# EAGLE design PAC_MiP POV v18_10_18_17_new_02 (EAGLE 8.3.2)
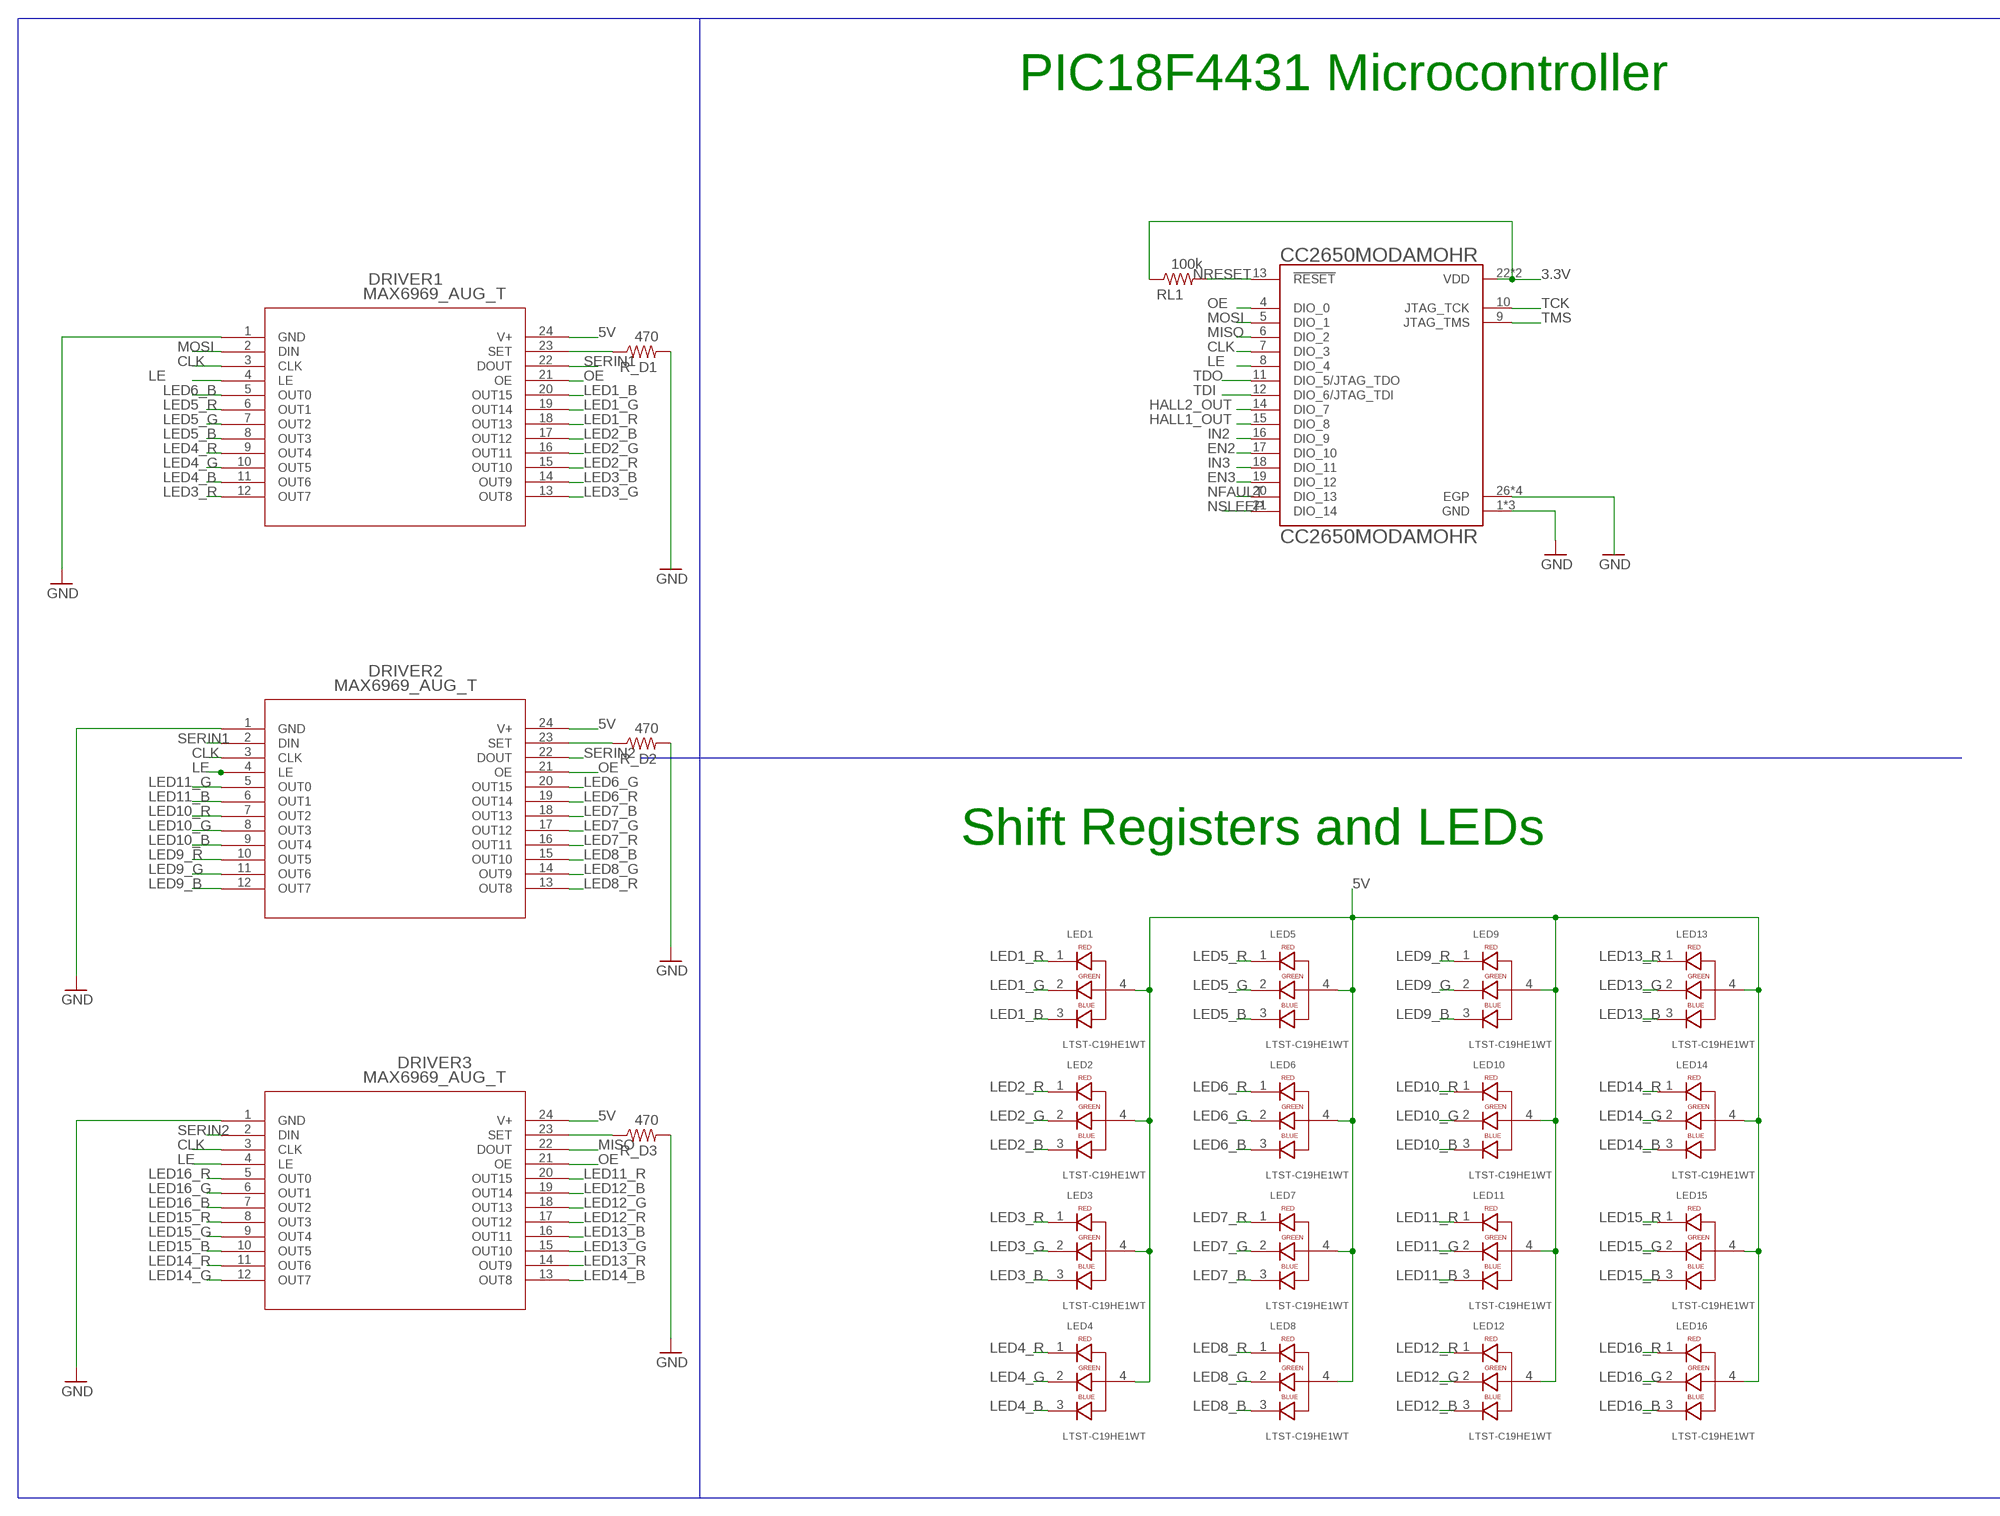
[diagram p0: schematic, sheet 1, part 1 of 2]
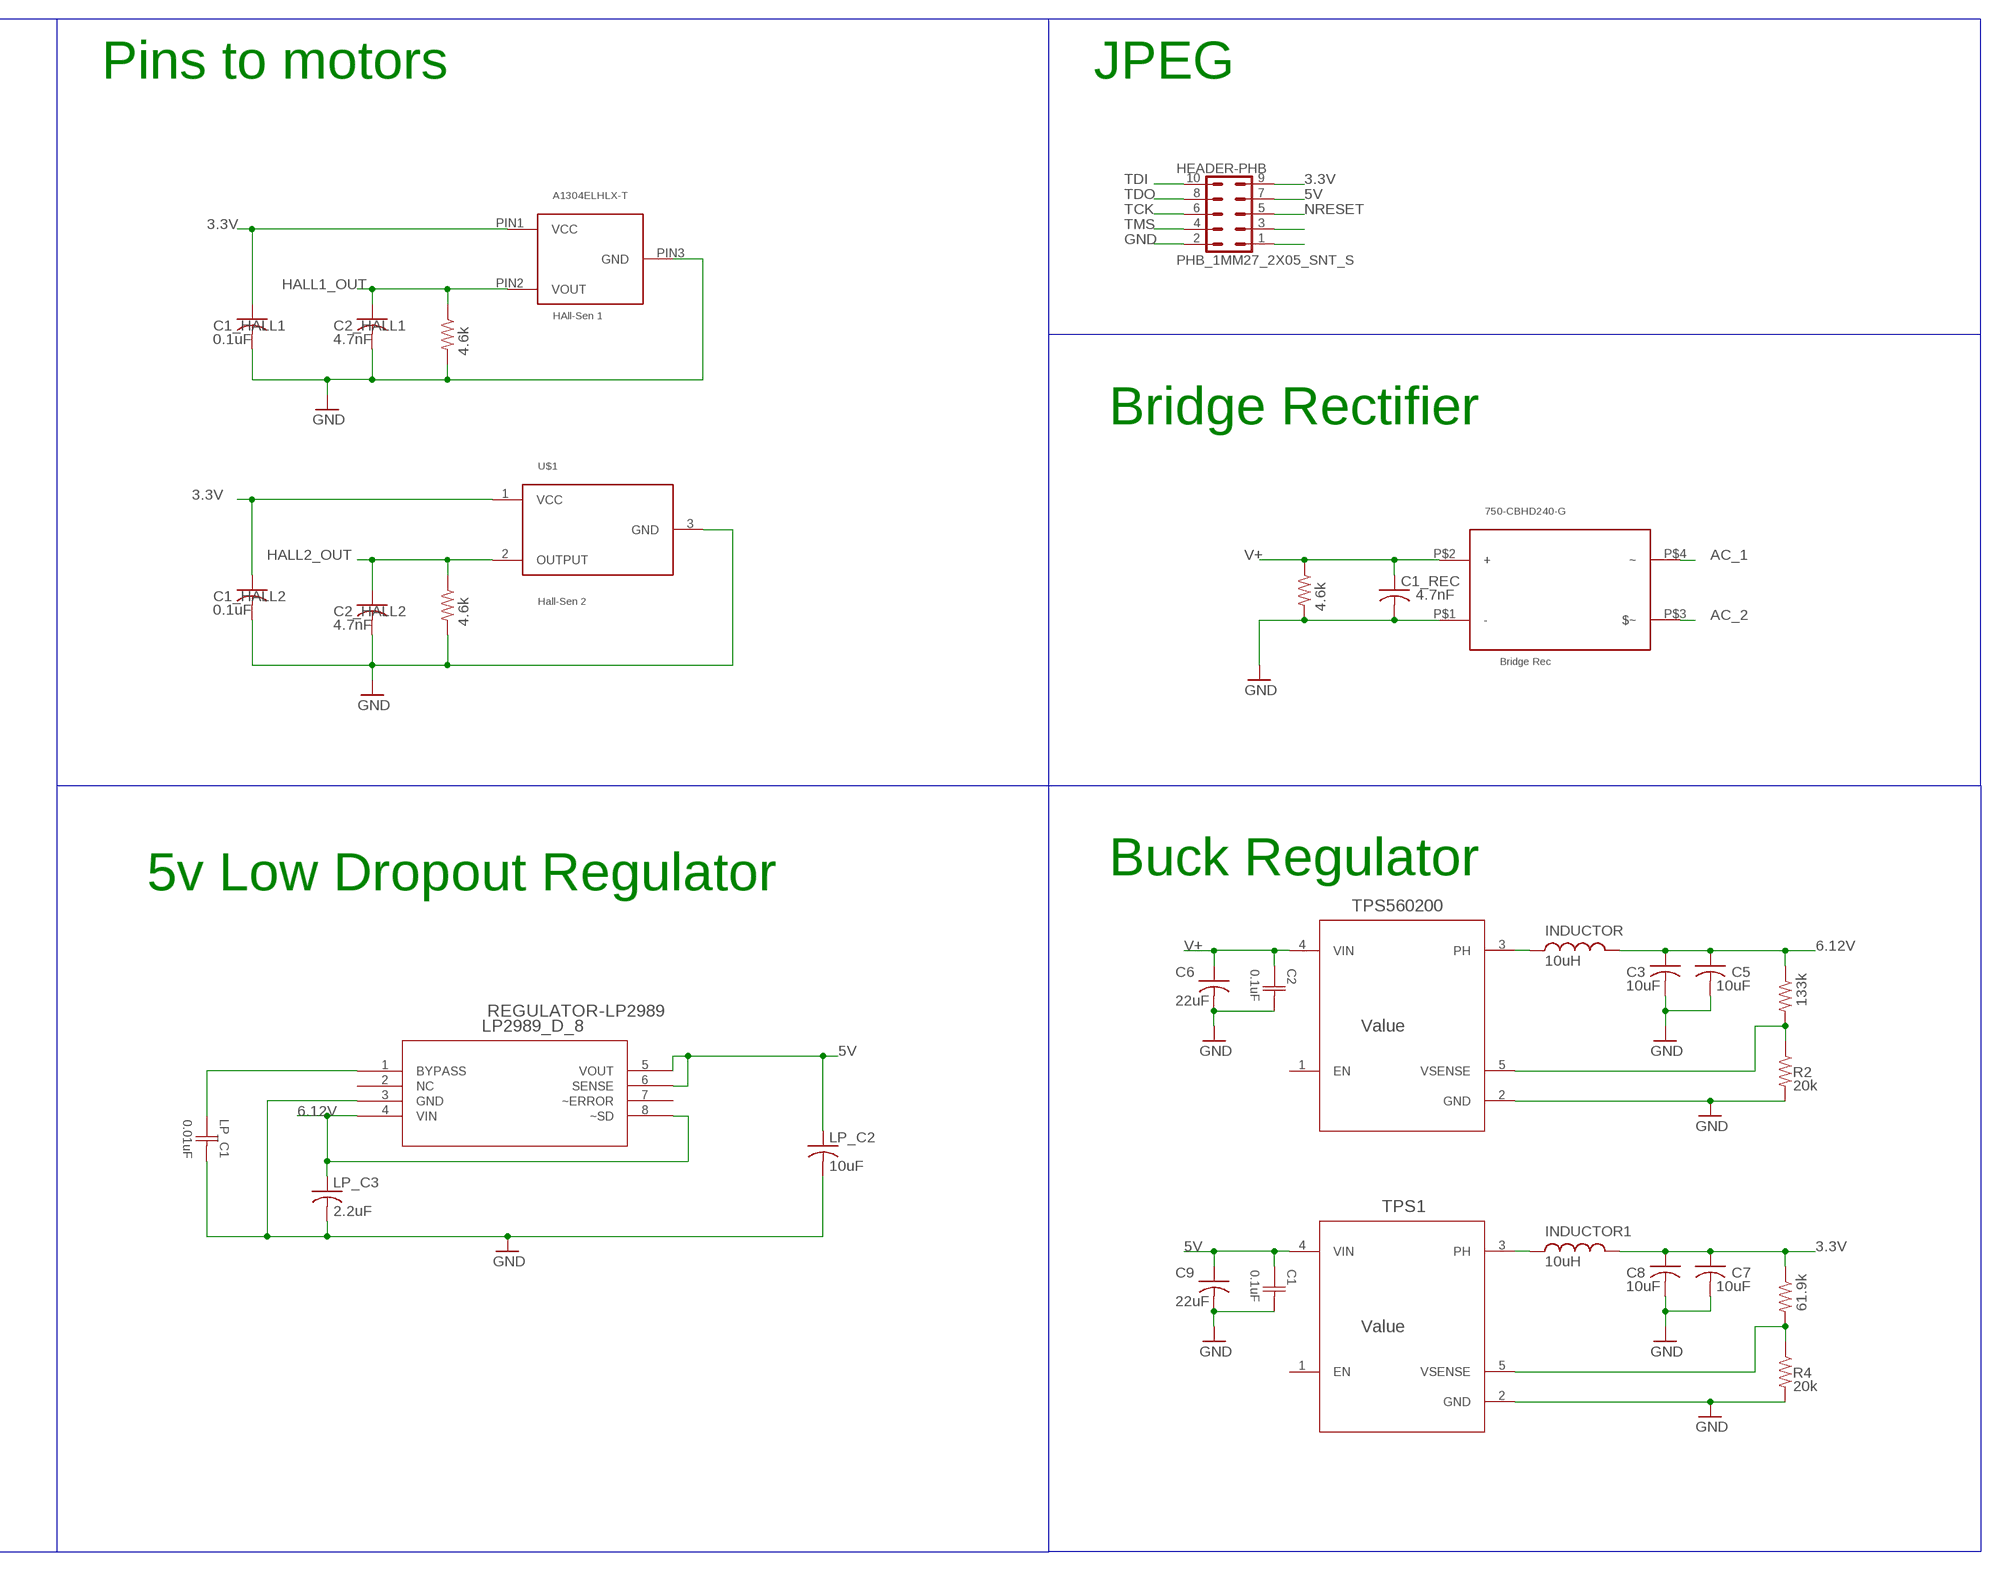
[diagram p1: schematic, sheet 1, part 2 of 2]

## Parts
750-CBHD240-G  Bridge Rec  750-CDBHD240-G  [750-CDBHD240-G]
A1304ELHLX-T  HAll-Sen 1  A1304ELHLX-T  [A1304ELHLX-T]
C1  0.1uF  05083C104MAT2A  [0508]
C1_HALL1  0.1uF  C-USC0805  [C0805]
C1_HALL2  0.1uF  C-USC0805  [C0805]
C1_REC  4.7nF  C-USC0805  [C0805]
C2  0.1uF  05083C104MAT2A  [0508]
C2_HALL1  4.7nF  C-USC0805  [C0805]
C2_HALL2  4.7nF  C-USC0805  [C0805]
C3  10uF  C-USC0805  [C0805]
C5  10uF  C-USC0805  [C0805]
C6  22uF  C-USC0805  [C0805]
C7  10uF  C-USC0805  [C0805]
C8  10uF  C-USC0805  [C0805]
C9  22uF  C-USC0805  [C0805]
CC2650MODAMOHR  CC2650MODAMOHR  [XCVR_CC2650MODAMOHR]
DRIVER1  MAX6969_AUG_T  [21_0066J_24]
DRIVER2  MAX6969_AUG_T  [21_0066J_24]
DRIVER3  MAX6969_AUG_T  [21_0066J_24]
HEADER-PHB  PHB_1MM27_2X05_SNT_S  [PHB_1MM27_2X05_SNT]
INDUCTOR  10uH  INDUCTOR-CDPH1D06F  [CDPH4D19FNP100MC]
INDUCTOR1  10uH  INDUCTOR-CDPH1D06F  [CDPH4D19FNP100MC]
LED1  LTST-C19HE1WT  [LEDSC85P160X160X35-4N]
LED2  LTST-C19HE1WT  [LEDSC85P160X160X35-4N]
LED3  LTST-C19HE1WT  [LEDSC85P160X160X35-4N]
LED4  LTST-C19HE1WT  [LEDSC85P160X160X35-4N]
LED5  LTST-C19HE1WT  [LEDSC85P160X160X35-4N]
LED6  LTST-C19HE1WT  [LEDSC85P160X160X35-4N]
LED7  LTST-C19HE1WT  [LEDSC85P160X160X35-4N]
LED8  LTST-C19HE1WT  [LEDSC85P160X160X35-4N]
LED9  LTST-C19HE1WT  [LEDSC85P160X160X35-4N]
LED10  LTST-C19HE1WT  [LEDSC85P160X160X35-4N]
LED11  LTST-C19HE1WT  [LEDSC85P160X160X35-4N]
LED12  LTST-C19HE1WT  [LEDSC85P160X160X35-4N]
LED13  LTST-C19HE1WT  [LEDSC85P160X160X35-4N]
LED14  LTST-C19HE1WT  [LEDSC85P160X160X35-4N]
LED15  LTST-C19HE1WT  [LEDSC85P160X160X35-4N]
LED16  LTST-C19HE1WT  [LEDSC85P160X160X35-4N]
LP_C1  0.01uF  LLL185R71E103MA01L  [LLL18]
LP_C2  10uF  C-USC0805  [C0805]
LP_C3  2.2uF  C-USC0805  [C0805]
R1  133k  R-US_R0805  [R0805]
R1_HALL  4.6k  R-US_R0805  [R0805]
R1_HALL2  4.6k  R-US_R0805  [R0805]
R1_REC  4.6k  R-US_R0805  [R0805]
R2  20k  R-US_R0805  [R0805]
R3  61.9k  R-US_R0805  [R0805]
R4  20k  R-US_R0805  [R0805]
R_D1  470  R-US_R0805  [R0805]
R_D2  470  R-US_R0805  [R0805]
R_D3  470  R-US_R0805  [R0805]
REGULATOR-LP2989  LP2989_D_8  [M08A]
RL1  100k  R-US_R0805  [R0805]
TPS1  Value  TPS560200DBVR  [DBV0005A_N]
TPS560200  Value  TPS560200DBVR  [DBV0005A_N]
U$1  Hall-Sen 2  SS39ET  [SOT-23-3]

## Nets
3.3V: A1304ELHLX-T.PIN1(VCC) C1_HALL1.1 C1_HALL2.1 C7.1 C8.1 CC2650MODAMOHR.22(VDD) CC2650MODAMOHR.23(VDD) HEADER-PHB.9 INDUCTOR1.P$2 R3.1 RL1.1 U$1.1(VCC)
5V: C1.1 C9.1 DRIVER1.24(V+) DRIVER2.24(V+) DRIVER3.24(V+) HEADER-PHB.7 LED1.4 LED2.4 LED3.4 LED4.4 LED5.4 LED6.4 LED7.4 LED8.4 LED9.4 LED10.4 LED11.4 LED12.4 LED13.4 LED14.4 LED15.4 LED16.4 LP_C2.1 REGULATOR-LP2989.5(VOUT) REGULATOR-LP2989.6(SENSE) TPS1.4(VIN)
6.12V: C3.1 C5.1 INDUCTOR.P$2 LP_C3.1 R1.1 REGULATOR-LP2989.4(VIN) REGULATOR-LP2989.8(~SD)
AC_1: 750-CBHD240-G.P$4(~)
AC_2: 750-CBHD240-G.P$3($~)
CLK: CC2650MODAMOHR.7(DIO_3) DRIVER1.3(CLK) DRIVER2.3(CLK) DRIVER3.3(CLK)
EN2: CC2650MODAMOHR.17(DIO_10)
EN3: CC2650MODAMOHR.19(DIO_12)
GND: 750-CBHD240-G.P$1(-) A1304ELHLX-T.PIN3(GND) C1.2 C1_HALL1.2 C1_HALL2.2 C1_REC.2 C2.2 C2_HALL1.2 C2_HALL2.2 C3.2 C5.2 C6.2 C7.2 C8.2 C9.2 CC2650MODAMOHR.1(GND) CC2650MODAMOHR.3(GND) CC2650MODAMOHR.25(GND) CC2650MODAMOHR.26(EGP) CC2650MODAMOHR.27(EGP) CC2650MODAMOHR.28(EGP) CC2650MODAMOHR.29(EGP) DRIVER1.1(GND) DRIVER2.1(GND) DRIVER3.1(GND) HEADER-PHB.2 LP_C1.2 LP_C2.2 LP_C3.2 R1_HALL2.2 R1_HALL.2 R1_REC.2 R2.2 R4.2 R_D2.2 R_D3.2 REGULATOR-LP2989.3(GND) TPS1.2(GND) TPS560200.2(GND) U$1.3(GND)
HALL1_OUT: A1304ELHLX-T.PIN2(VOUT) C2_HALL1.1 CC2650MODAMOHR.15(DIO_8) R1_HALL.1
HALL2_OUT: C2_HALL2.1 CC2650MODAMOHR.14(DIO_7) R1_HALL2.1 U$1.2(OUTPUT)
IN2: CC2650MODAMOHR.16(DIO_9)
IN3: CC2650MODAMOHR.18(DIO_11)
LE: CC2650MODAMOHR.8(DIO_4) DRIVER1.4(LE) DRIVER2.4(LE) DRIVER3.4(LE)
LED1_B: DRIVER1.20(OUT15) LED1.3
LED1_G: DRIVER1.19(OUT14) LED1.2
LED1_R: DRIVER1.18(OUT13) LED1.1
LED2_B: DRIVER1.17(OUT12) LED2.3
LED2_G: DRIVER1.16(OUT11) LED2.2
LED2_R: DRIVER1.15(OUT10) LED2.1
LED3_B: DRIVER1.14(OUT9) LED3.3
LED3_G: DRIVER1.13(OUT8) LED3.2
LED3_R: DRIVER1.12(OUT7) LED3.1
LED4_B: DRIVER1.11(OUT6) LED4.3
LED4_G: DRIVER1.10(OUT5) LED4.2
LED4_R: DRIVER1.9(OUT4) LED4.1
LED5_B: DRIVER1.8(OUT3) LED5.3
LED5_G: DRIVER1.7(OUT2) LED5.2
LED5_R: DRIVER1.6(OUT1) LED5.1
LED6_B: DRIVER1.5(OUT0) LED6.3
LED6_G: DRIVER2.20(OUT15) LED6.2
LED6_R: DRIVER2.19(OUT14) LED6.1
LED7_B: DRIVER2.18(OUT13) LED7.3
LED7_G: DRIVER2.17(OUT12) LED7.2
LED7_R: DRIVER2.16(OUT11) LED7.1
LED8_B: DRIVER2.15(OUT10) LED8.3
LED8_G: DRIVER2.14(OUT9) LED8.2
LED8_R: DRIVER2.13(OUT8) LED8.1
LED9_B: DRIVER2.12(OUT7) LED9.3
LED9_G: DRIVER2.11(OUT6) LED9.2
LED9_R: DRIVER2.10(OUT5) LED9.1
LED10_B: DRIVER2.9(OUT4) LED10.3
LED10_G: DRIVER2.8(OUT3) LED10.2
LED10_R: DRIVER2.7(OUT2) LED10.1
LED11_B: DRIVER2.6(OUT1) LED11.3
LED11_G: DRIVER2.5(OUT0) LED11.2
LED11_R: DRIVER3.20(OUT15) LED11.1
LED12_B: DRIVER3.19(OUT14) LED12.3
LED12_G: DRIVER3.18(OUT13) LED12.2
LED12_R: DRIVER3.17(OUT12) LED12.1
LED13_B: DRIVER3.16(OUT11) LED13.3
LED13_G: DRIVER3.15(OUT10) LED13.2
LED13_R: DRIVER3.14(OUT9) LED13.1
LED14_B: DRIVER3.13(OUT8) LED14.3
LED14_G: DRIVER3.12(OUT7) LED14.2
LED14_R: DRIVER3.11(OUT6) LED14.1
LED15_B: DRIVER3.10(OUT5) LED15.3
LED15_G: DRIVER3.9(OUT4) LED15.2
LED15_R: DRIVER3.8(OUT3) LED15.1
LED16_B: DRIVER3.7(OUT2) LED16.3
LED16_G: DRIVER3.6(OUT1) LED16.2
LED16_R: DRIVER3.5(OUT0) LED16.1
MISO: CC2650MODAMOHR.6(DIO_2) DRIVER3.22(DOUT)
MOSI: CC2650MODAMOHR.5(DIO_1) DRIVER1.2(DIN)
N$1: INDUCTOR.P$1 TPS560200.3(PH)
N$2: DRIVER3.23(SET) R_D3.1
N$3: R1.2 R2.1 TPS560200.5(VSENSE)
N$5: R3.2 R4.1 TPS1.5(VSENSE)
N$6: INDUCTOR1.P$1 TPS1.3(PH)
N$7: DRIVER2.23(SET) R_D2.1
N$8: DRIVER1.23(SET) R_D1.1
N$10: LP_C1.1 REGULATOR-LP2989.1(BYPASS)
N$11: R_D1.2
N$45: HEADER-PHB.3
N$48: HEADER-PHB.1
NFAULT: CC2650MODAMOHR.20(DIO_13)
NRESET: CC2650MODAMOHR.13(!RESET) HEADER-PHB.5 RL1.2
NSLEEP: CC2650MODAMOHR.21(DIO_14)
OE: CC2650MODAMOHR.4(DIO_0) DRIVER1.21(OE) DRIVER2.21(OE) DRIVER3.21(OE)
SERIN1: DRIVER1.22(DOUT) DRIVER2.2(DIN)
SERIN2: DRIVER2.22(DOUT) DRIVER3.2(DIN)
TCK: CC2650MODAMOHR.10(JTAG_TCK) HEADER-PHB.6
TDI: CC2650MODAMOHR.12(DIO_6/JTAG_TDI) HEADER-PHB.10
TDO: CC2650MODAMOHR.11(DIO_5/JTAG_TDO) HEADER-PHB.8
TMS: CC2650MODAMOHR.9(JTAG_TMS) HEADER-PHB.4
V+ [small]: 750-CBHD240-G.P$2(+) C1_REC.1 C2.1 C6.1 R1_REC.1 TPS560200.4(VIN)
Unconnected: REGULATOR-LP2989.2(NC) REGULATOR-LP2989.7(~ERROR) TPS1.1(EN) TPS560200.1(EN)

## Buses
B$1

## Notes on the sheet
- PIC18F4431 Microcontroller | Pins to motors | JPEG
- Bridge Rectifier
- Shift Registers and LEDs | 5v Low Dropout Regulator | Buck Regulator

## Library data of the parts
750-CBHD240-G = 750-CDBHD240-G:750-CDBHD240-G
A1304ELHLX-T = A1304ELHLX-T:A1304ELHLX-T: SENSOR LINEAR ANALOG SOT23W>Digikey product 620-1548-1-ND >Allegro MicroSystems, LLC A1304ELHLX-T >https://www.digikey.com/product-detail/en/allegro-microsystems-llc/A1304ELHLX-T/620-1548-1-ND/4552949
C1 C2 = Capacitors0508&0306:05083C104MAT2A; COPYRIGHT: Copyright (C) 2015 Accelerated Designs. All rights reserved; MANUFACTURER_PART_NUMBER: 05083C104MAT2A; OC_NEWARK: unknown; VENDOR: Vendor
C1_HALL1 C1_HALL2 C1_REC C2_HALL1 C2_HALL2 C3 C5-C9 LP_C2 LP_C3 = adafruit:C-US: CAPACITOR, American symbol; OC_NEWARK: unknown
CC2650MODAMOHR = CC2650MODAMOHR:CC2650MODAMOHR: SimpleLink™ Bluetooth® low energy Wireless MCU Module 29-QFM -40 to 85; AVAILABILITY: Good; DESCRIPTION: SimpleLink™ Bluetooth® low energy Wireless MCU Module 29-QFM -40 to 85; MF: Texas Instruments; MP: CC2650MODAMOHR; PACKAGE: SMD-29 Texas Instruments; PRICE: 9.40 USD
DRIVER1-DRIVER3 = MAX6868AUG:MAX6969_AUG_T
HEADER-PHB = _hhn_con_pinhead_box_1mm27:PHB_1MM27_2X05_?_S: Pin Header Box-Type, 1.27mm/0.5"/50mil Pitch, 2x05 Circuits, single gates in schematic Note: see library description for an important note about THT-version
INDUCTOR INDUCTOR1 = Inductor - CDPH4D19FNP100MC:INDUCTOR-CDPH1D06F
LED1-LED16 = LTST-C19HE1WT:LTST-C19HE1WT: R/G/B 0606 Flat Top Rectangle 130° 112.5/281/104 mcd Diffused Chip LED; AVAILABILITY: Good; DESCRIPTION: R/G/B 0606 Flat Top Rectangle 130° 112.5/281/104 mcd Diffused Chip LED; MF: Lite-On; MP: LTST-C19HE1WT; PACKAGE: 0606 Lite-On; PRICE: 0.25 USD
LP_C1 = Capacitors0508&0306:LLL185R71E103MA01L; COPYRIGHT: Copyright (C) 2015 Accelerated Designs. All rights reserved; MANUFACTURER_PART_NUMBER: LLL185R71E103MA01L; OC_NEWARK: unknown; VENDOR: Vendor
R1 R1_HALL R1_HALL2 R1_REC R2-R4 = adafruit:R-US_: RESISTOR, American symbol; OC_NEWARK: unknown
R_D1-R_D3 RL1 = resistor:R-US_: RESISTOR, American symbol; OC_NEWARK: unknown
REGULATOR-LP2989 = LP2989:LP2989_D_8; BASE_PN: LP2989; COMP: TypeLDO; LIBRARY: ReferenceLP2989AIM; OC_NEWARK: unknown; PARTNUMBER: LP2989AIM-18; PIN: Count8; SYMBOL: NameLP2989AIM-18; TYPE: LP2989AIM-1.8; VENDOR: NationalSemiconductor; VERSION: 1
TPS1 TPS560200 = TPS560200:TPS560200DBVR; COMPTYPE: IC; MANUFACTURER: Texas Instruments; MOUNTTYPE: SMT; OC_NEWARK: unknown; PACKAGEREFERENCE: DBV0005A; PARTNUMBER: TPS560200DBV; PIN_COUNT: 5; REFDES: RefDes; ROHS: Y; TYPE: TYPE
U$1 = SS39ET:SS39ET: Part SS39ET from Honeywell, part can be bought from digikey at https://www.digikey.com/product-detail/en/honeywell-sensing-and-productivity-solutions/SS39ET/480-3845-1-ND/2839726

## Net classes
1 power: width 0.762 mm, clearance 0.254 mm to class 0, clearance 0.508 mm
2 small: width 0.254 mm, clearance 0.254 mm to class 1

## Board
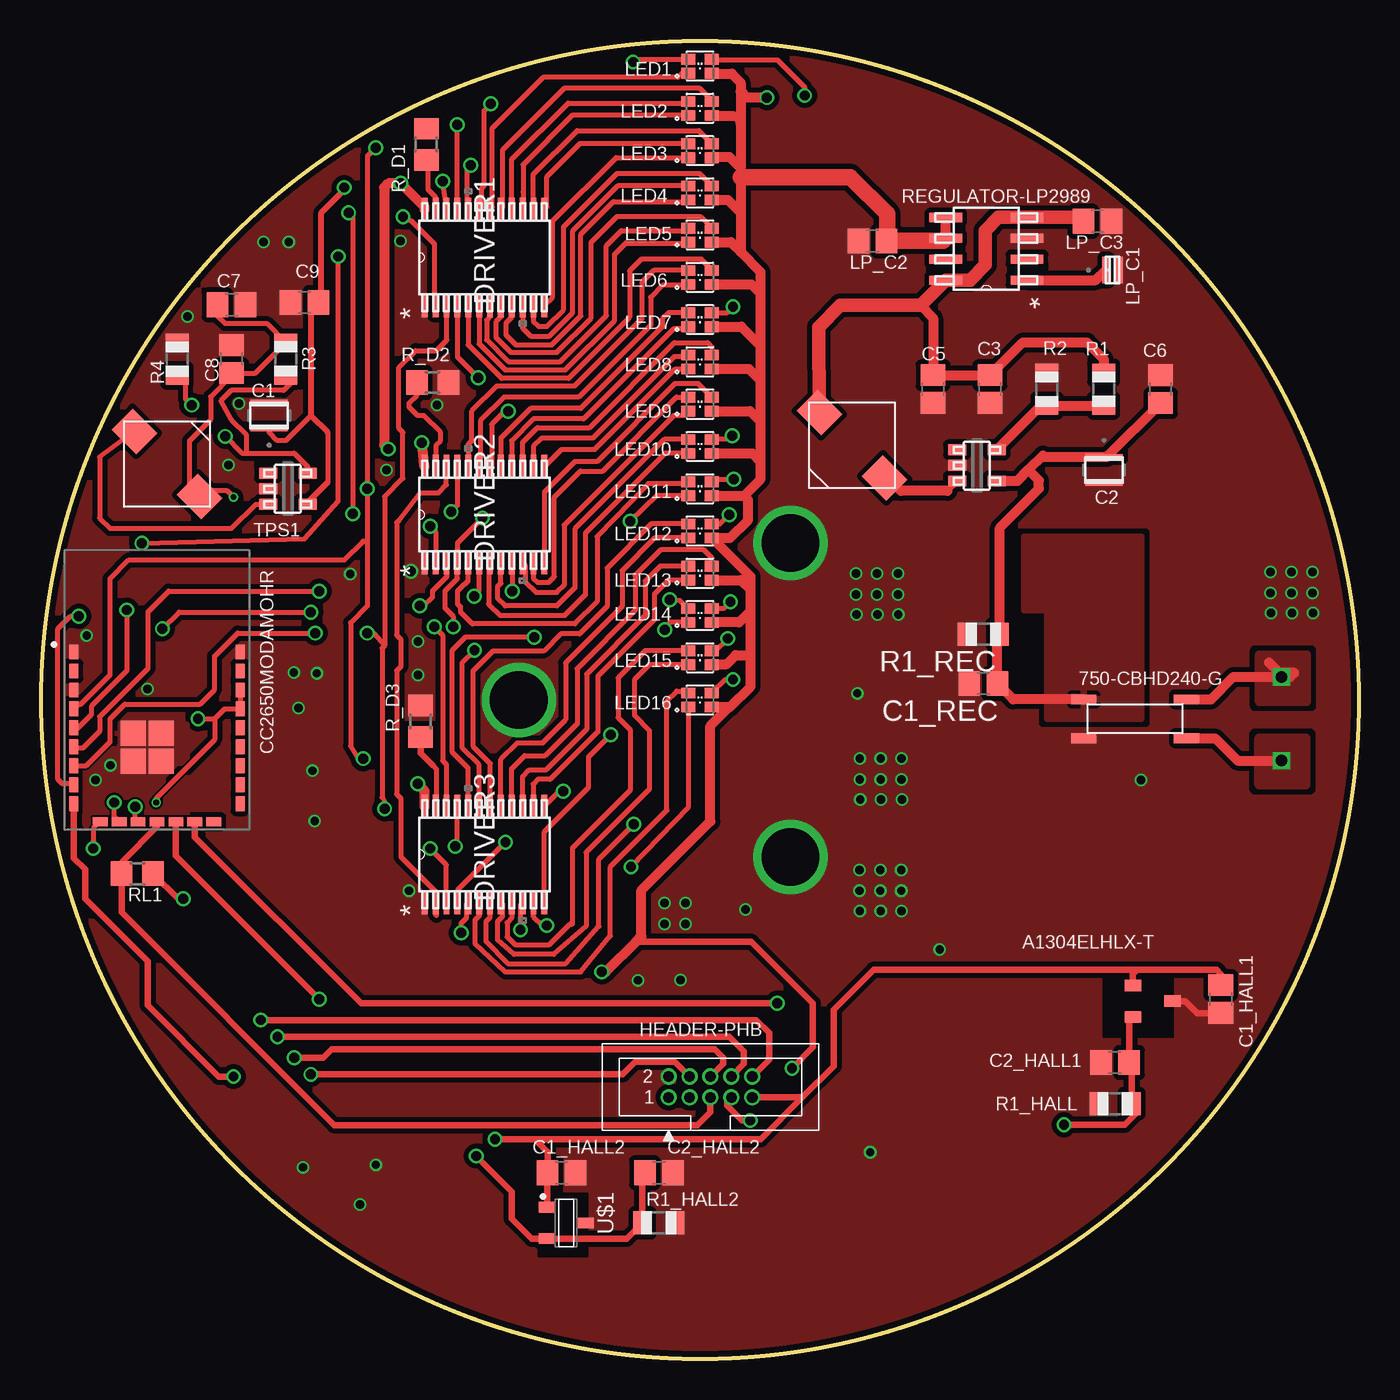
[diagram p2: board, top side]
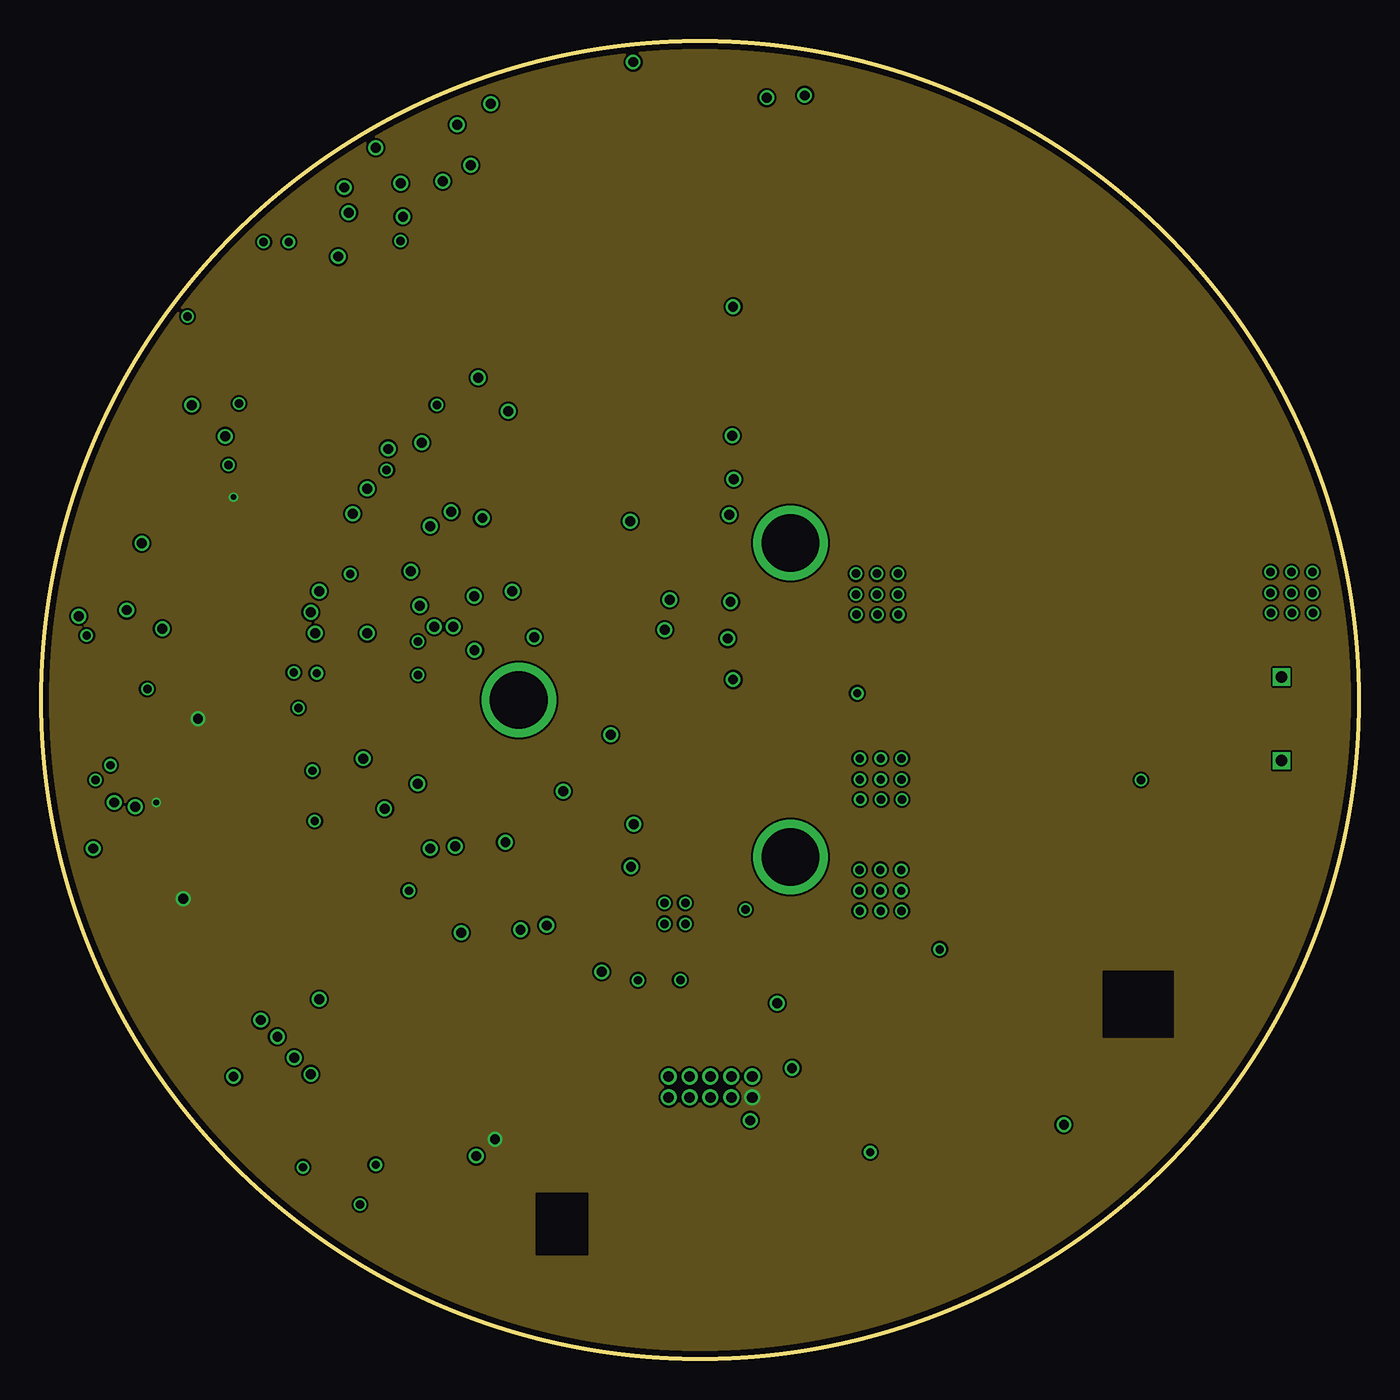
[diagram p3: board, inner layer Route2]
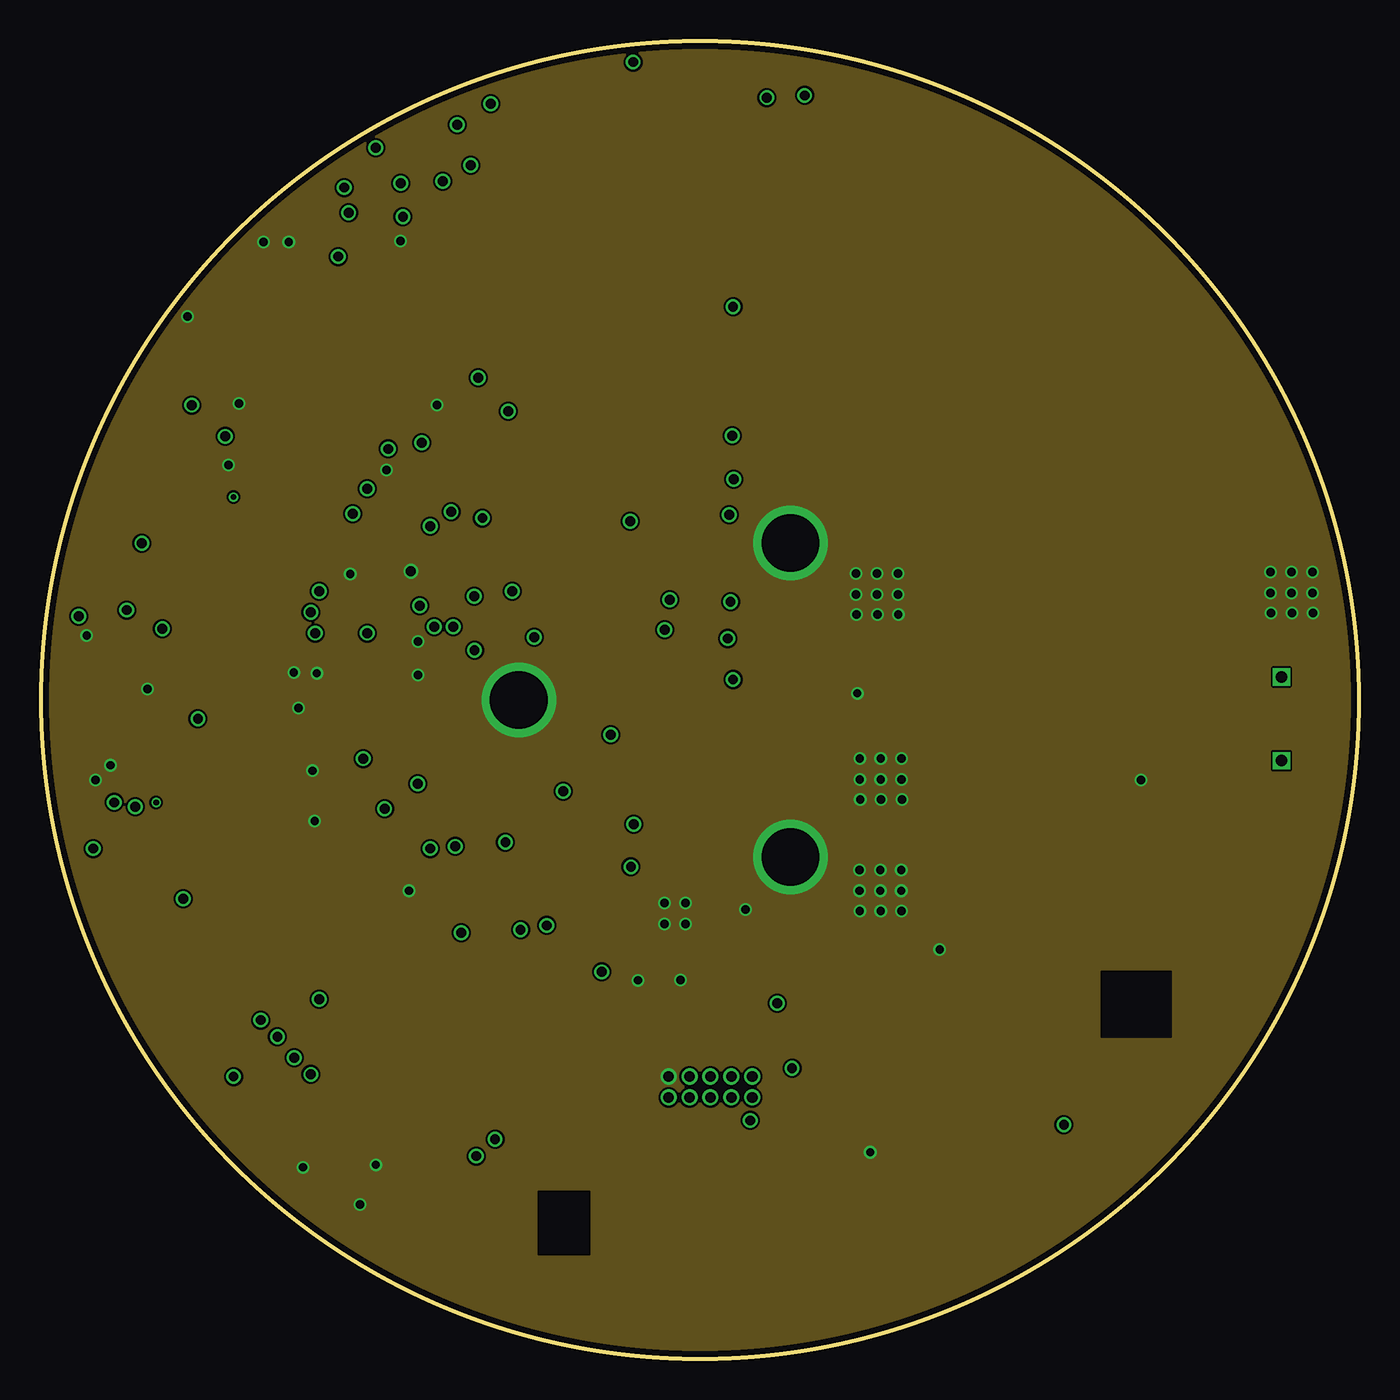
[diagram p4: board, inner layer Route15]
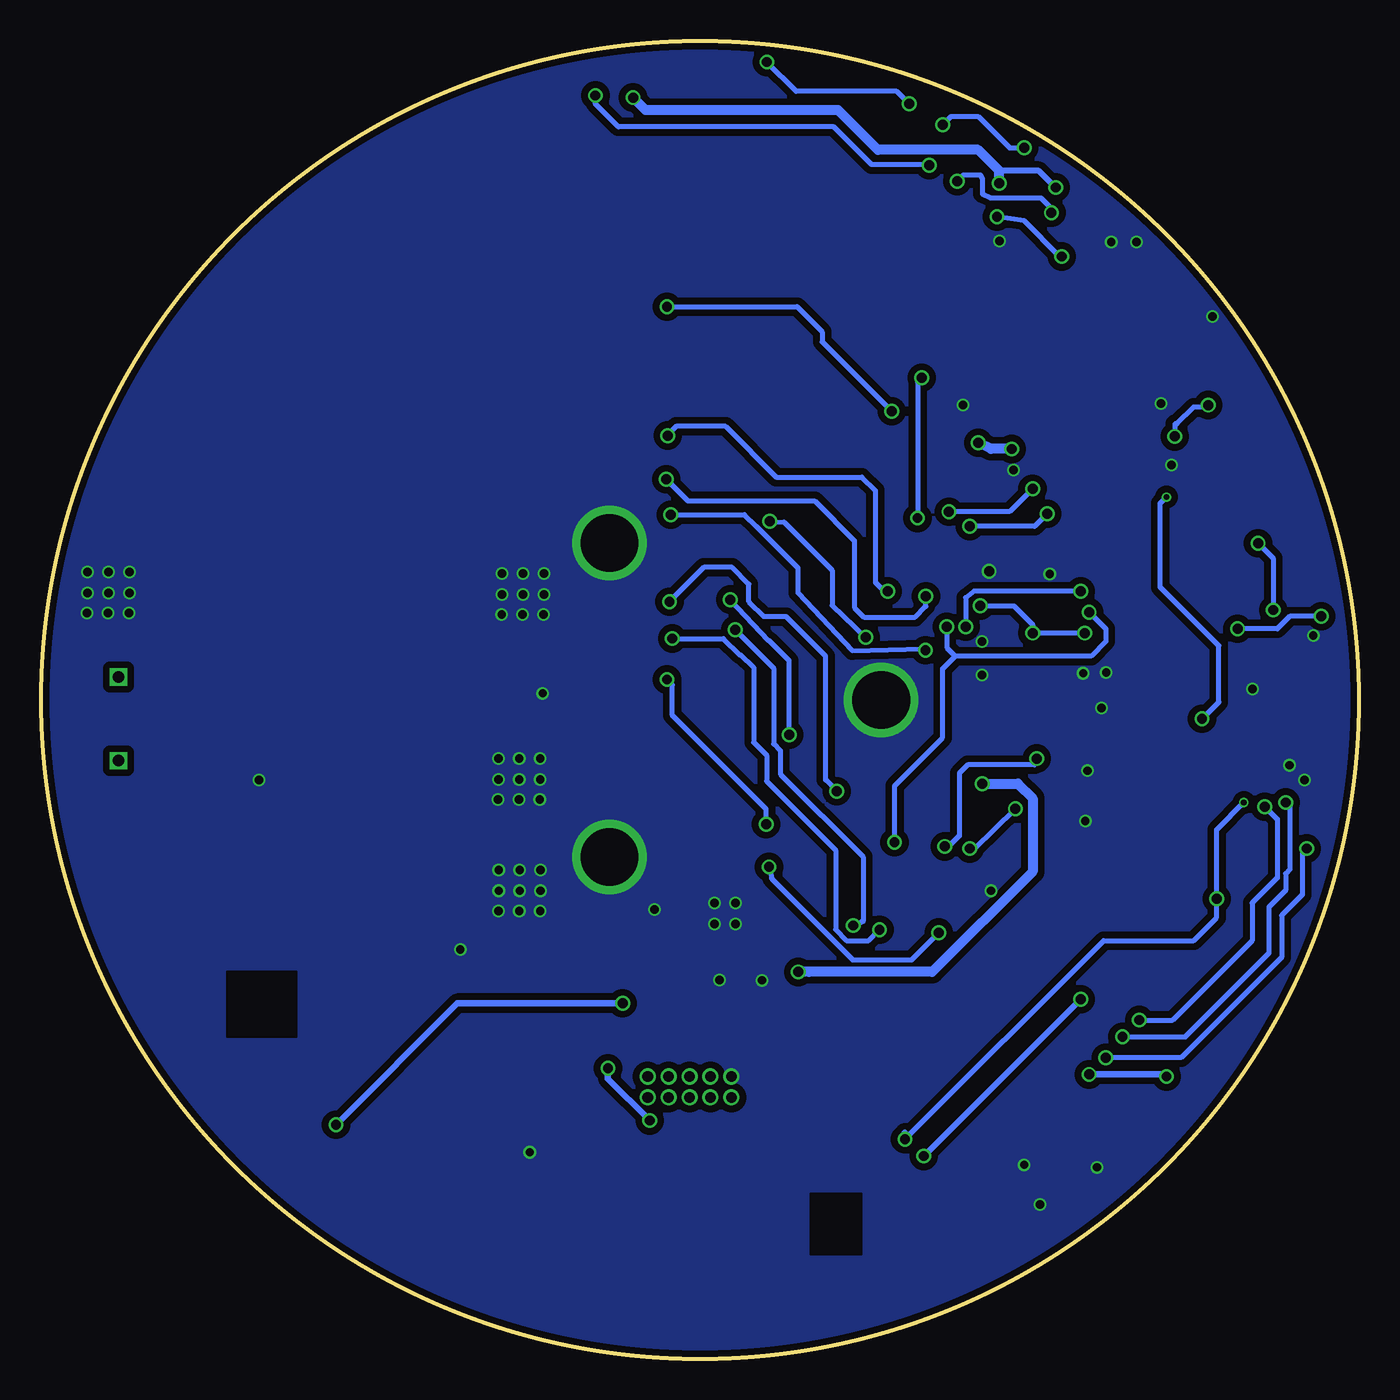
[diagram p5: board, bottom side, seen from below]

Size 80 x 80 mm. Coordinates in mm from the lower left corner, seen from the top.
Outline: circle at 40,40 radius 40
Copper layers (1*2*15*16): Top 0.035559375mm / dielectric 0.17018125mm / Route2 0.01778125mm / dielectric 47mil / Route15 0.01778125mm / dielectric 0.17018125mm / Bottom 0.035559375mm
Design rules "OSHPark-4layer": minimum track width 5mil, minimum drill 10mil, track to track 5mil, track to pad 5mil, pad to pad 5mil, via to via 5mil, smd to smd 5mil, copper to edge 15mil, drill to drill 6mil, minimum pad ring 4mil, minimum via ring 4mil, stop-mask expansion 2.5mil, vias tented up to drill 0mil, thermal gap 10mil

### Footprints (pad centres in the part's own frame; a part is rotated, then mirrored left to right if it is on the bottom)
750-CDBHD240-G = smd 1.524 x 0.584: P$1 -3.124,-1.181; P$2 -3.124,1.181; P$3 3.124,-1.181; P$4 3.124,1.181
A1304ELHLX-T = smd 0.7 x 1: PIN1 -0.95,0; PIN2 0.95,0; PIN3 0,2.4
0508 = smd 0.33 x 2.286: 1 -0.8,0; 2 0.8,0
C0805 = smd 1.3 x 1.5: 1 -0.85,0; 2 0.85,0
XCVR_CC2650MODAMOHR = smd 0.55 x 0.9: 1 -5.05,2.3; 2 -5.05,1.15; 3 -5.05,0; 4 -5.05,-1.15; 5 -5.05,-2.3; 6 -5.05,-3.45; 7 -5.05,-4.6; 8 -5.05,-5.75; 9 -5.05,-6.9; 17 5.05,-6.9; 18 5.05,-5.75; 19 5.05,-4.6; 20 5.05,-3.45; 21 5.05,-2.3; 22 5.05,-1.15; 23 5.05,0; 24 5.05,1.15; 25 5.05,2.3 | smd 0.9 x 0.55: 10 -3.45,-8; 11 -2.3,-8; 12 -1.15,-8; 13 0,-8; 14 1.15,-8; 15 2.3,-8; 16 3.45,-8 | smd 1.5 x 1.5: 26 -1.435,-2.625; 27 -1.435,-4.325; 28 0.265,-4.325; 29 0.265,-2.625
21_0066J_24 = smd 1.422 x 0.356: 1 -2.921,3.632; 2 -2.921,2.972; 3 -2.921,2.311; 4 -2.921,1.651; 5 -2.921,0.991; 6 -2.921,0.33; 7 -2.921,-0.33; 8 -2.921,-0.991; 9 -2.921,-1.651; 10 -2.921,-2.311; 11 -2.921,-2.972; 12 -2.921,-3.632; 13 2.921,-3.632; 14 2.921,-2.972; 15 2.921,-2.311; 16 2.921,-1.651; 17 2.921,-0.991; 18 2.921,-0.33; 19 2.921,0.33; 20 2.921,0.991; 21 2.921,1.651; 22 2.921,2.311; 23 2.921,2.972; 24 2.921,3.632
PHB_1MM27_2X05_SNT = drill 0.65: 1 -2.54,-0.635; 2 -2.54,0.635; 3 -1.27,-0.635; 4 -1.27,0.635; 5 0,-0.635; 6 0,0.635; 7 1.27,-0.635; 8 1.27,0.635; 9 2.54,-0.635; 10 2.54,0.635
CDPH4D19FNP100MC = smd 1.8 x 2.1 rotated 45: P$1 -1.98,1.98; P$2 1.98,-1.98
LEDSC85P160X160X35-4N = smd 0.65 x 0.85: 1 -0.425,0.725; 2 0.425,0.725; 3 0.425,-0.725; 4 -0.425,-0.725
LLL18 = smd 0.457 x 1.6: 1 -0.381,0; 2 0.381,0
R0805 = smd 1.1 x 1.4: 1 -1,0; 2 1,0
R0805' = smd 1.3 x 1.5: 1 -0.95,0; 2 0.95,0
M08A = smd 1.981 x 0.559: 1 -2.464,1.905; 2 -2.464,0.635; 3 -2.464,-0.635; 4 -2.464,-1.905; 5 2.464,-1.905; 6 2.464,-0.635; 7 2.464,0.635; 8 2.464,1.905
DBV0005A_N = smd 1.092 x 0.66: 1 -1.2,0.95; 2 -1.2,0; 3 -1.2,-0.95; 4 1.2,-0.95; 5 1.2,0.95
SOT-23-3 = smd 0.65 x 1.05: 1 -0.95,-1.15; 2 0.95,-1.15; 3 0,1.15

### Placement (x,y rotation side)
750-CBHD240-G  66.42,38.86 0 top
A1304ELHLX-T  66.29,21.71 270 top
C1  13.84,57.27 90 top
C1_HALL1  71.62,21.84 270 top
C1_HALL2  31.6,11.29 0 top
C1_REC  57.2,40.99 180 top
C2  64.53,53.97 270 top
C2_HALL1  65.2,17.99 180 top
C2_HALL2  37.5,11.29 0 top
C3  57.6,58.87 270 top
C5  54.15,58.87 270 top
C6  67.97,58.87 90 top
C7  11.55,64 0 top
C8  11.55,60.7 90 top
C9  16,64.13 180 top
CC2650MODAMOHR  7.03,40.61 0 top
DRIVER1  26.92,66.87 90 top
DRIVER2  26.92,51.25 90 top
DRIVER3  26.92,30.63 90 top
HEADER-PHB  40.64,16.5 0 top
INDUCTOR  49.23,55.47 180 top
INDUCTOR1  7.64,54.33 0 top
LED1  40,78.48 90 top
LED2  40,75.92 90 top
LED3  40,73.35 90 top
LED4  40,70.78 90 top
LED5  40,68.22 90 top
LED6  40,65.65 90 top
LED7  40,63.09 90 top
LED8  40,60.52 90 top
LED9  40,57.96 90 top
LED10  40,55.39 90 top
LED11  40,52.83 90 top
LED12  40,50.26 90 top
LED13  40,47.7 90 top
LED14  40,45.13 90 top
LED15  40,42.57 90 top
LED16  40,40 90 top
LP_C1  65.04,66.11 0 top
LP_C2  50.47,67.87 180 top
LP_C3  64.13,69.07 0 top
R1  64.51,58.87 270 top
R1_HALL  65.2,15.49 180 top
R1_HALL2  37.5,8.25 0 top
R1_REC  57.2,43.99 180 top
R2  61.06,58.87 90 top
R3  14.85,60.7 270 top
R4  8.25,60.7 90 top
R_D1  470  [R0805']  23.39,73.73 90 top
R_D2  470  [R0805']  23.77,59.28 0 top
R_D3  470  [R0805']  23.03,38.7 90 top
REGULATOR-LP2989  57.39,67.39 180 top
RL1  100k  [R0805']  5.84,29.46 180 top
TPS1  14.98,52.83 0 top
TPS560200  56.82,54.24 0 top
U$1  31.87,8.25 270 top

### Tracks (layer width: path | path; a pad name or v marks a point on that pad's centre or on a via)
3.3V  (via drill 0.35, 0.6)
  Top 0.305: 10.54,38.86 10.54,37.59 6.98,34.03 v6.98,33.78 | 10.54,38.86 11.14,39.46 CC2650MODAMOHR.22 CC2650MODAMOHR.23 | C7.1 10.7,63.33 11.17,62.86 13.7,62.86 R3.1 13,59.85 C8.1 11.55,59.68 10.28,58.41 10.28,57.02 9.01,55.75 9.01,52.7 | 9.01,52.7 9.01,52.45 INDUCTOR1.P$2 | v9.52,38.86 10.54,38.86 | v11.68,52.32 11.3,52.7 9.01,52.7
  Top 0.406: 29.97,13.33 43.68,13.33 46.22,15.87 | 29.97,13.33 v27.55,13.33 | 29.97,13.33 30.77,12.53 C1_HALL2.1 30.72,11.27 U$1.1 | HEADER-PHB.9 46.22,15.87 | 46.22,15.87 48.13,17.77 48.13,21.2 50.54,23.62 66.54,23.62 | C1_HALL1.1 71.62,23.36 71.37,23.62 66.54,23.62 | A1304ELHLX-T.PIN1 66.29,23.36 66.54,23.62 | RL1.1 8.31,27.93 v8.63,27.93
  Bottom 0.305: v9.52,38.86 8.5,39.87 8.5,43.3 12.06,46.86 12.06,51.94 v11.68,52.32 | v6.98,33.78 8.63,32.13 v8.63,27.93 8.63,26.79 10.03,25.39 15.49,25.39 v27.55,13.33
  Bottom 0.406: 27.55,13.71 v27.55,13.33
  pour Route2 (no thermals): -10.16,80.51 92.2,80.51 92.2,-0.77 -10.16,-0.77
  cutout Route2: 64.51,23.49 68.7,23.49 68.7,19.55 64.51,19.55
  cutout Route2: 30.09,10.03 33.14,10.03 33.14,6.34 30.09,6.34
5V  (via drill 0.6)
  Top 0.305: 16.38,63.66 C9.1 17.01,64.3 | 16.38,57.27 14.85,55.75 14.35,55.75 13.84,56.26 C1.1 | 17.39,56.26 17.39,53.21 | 16.18,51.99 TPS1.4 | 18.41,70.99 v18.41,71.12
  Top 0.356: 16.38,63.66 16.38,57.27 17.39,56.26 | 17.39,53.21 16.18,51.99 | 17.01,64.3 17.01,69.59 18.41,70.99
  Top 0.406: LED3.4 40.77,72.97 | LED1.4 40.76,78.02 | 42.46,72.28 42.46,71.75 | LED2.4 40.76,75.46 | 42.01,75.46 42.46,75 | LED15.4 40.77,42.18 | LED14.4 40.79,44.77 | 36.13,25.33 43.11,25.33 46.86,21.58 46.86,18.92 v45.59,17.65 | v43.05,14.47 42.54,14.47 41.65,15.36 41.65,15.62 HEADER-PHB.7
  Top 0.61: 40.76,78.02 41.93,78.02 42.46,77.49 42.46,76.96 | 42.46,76.96 42.46,75 42.46,72.28 41.78,72.97 40.77,72.97 | 42.46,71.75 42.46,69.59 | 42.46,69.59 42.46,67.2 | LED4.4 41.7,70.36 42.46,69.59 | LED5.4 41.87,67.79 42.46,67.2 | 40.76,75.46 42.01,75.46 | LED11.4 42.67,52.4 | 42.67,52.4 43.68,53.41 43.68,54.48 | 43.68,54.48 43.68,56.89 | 43.68,56.89 43.68,59.38 | 43.68,59.38 43.68,61.49 | 43.68,61.49 43.68,64.66 | 43.68,64.66 43.68,65.98 42.46,67.2 | LED6.4 43.12,65.23 43.68,64.66 | LED7.4 42.51,62.66 43.68,61.49 | LED8.4 42.97,60.1 43.68,59.38 | LED9.4 43.04,57.53 43.68,56.89 | LED10.4 43.19,54.97 43.68,54.48 | LED16.4 41.78,39.57 | 41.78,39.57 41.84,39.57 43.07,40.81 43.07,42.72 | 43.07,42.72 43.07,45.41 | 43.07,45.41 43.07,46.68 | 43.07,46.68 43.07,47.49 LED12.4 41.84,49.84 42.92,50.92 42.92,52.15 42.67,52.4 | 40.77,42.18 41.63,42.18 42.16,42.72 43.07,42.72 | DRIVER1.24 23.29,69.92 v21.84,71.37 21.08,71.37 20.82,71.12 20.82,55.49 v21.08,55.24 | v44.06,76.58 42.85,76.58 42.46,76.96 | DRIVER3.24 23.29,34.49 v22.86,34.92 | 41.78,39.57 40.64,38.43 40.64,32.63 36.44,28.44 36.44,25.65 36.13,25.33 34.29,23.49 v34.03,23.49 | v23.11,55.62 23.24,54.22 DRIVER2.24 | 43.07,45.41 42.37,44.71 LED14.4 | LED13.4 42.48,47.27 43.07,46.68 | REGULATOR-LP2989.6 REGULATOR-LP2989.5
  Top 1.016: REGULATOR-LP2989.6 54.77,67.87 LP_C2.1 51.35,67.9 51.35,69.51 49.12,71.75 42.46,71.75
  Bottom 0.305: 32.67,23.49 33.4,23.49
  Bottom 0.356: v18.41,71.12 19.43,72.13 21.84,72.13
  Bottom 0.406: v45.59,17.65 45.59,17.01 v43.05,14.47
  Bottom 0.61: v21.84,71.37 21.84,72.13 23.11,73.4 29.21,73.4 31.62,75.81 43.3,75.81 v44.06,76.58 | v22.86,34.92 20.7,34.92 19.81,34.03 19.81,29.59 25.9,23.49 33.4,23.49 v34.03,23.49 | v21.08,55.24 22.35,55.24 v23.11,55.62
6.12V
  Top 0.61: 53.39,63.95 54.15,63.19 C5.1 C3.1 59.6,61.72 63.5,61.72 64.51,60.7 R1.1
  Top 0.813: INDUCTOR.P$2 47.2,62.64 48.51,63.95 53.39,63.95 REGULATOR-LP2989.8 56.39,65.49 57.32,66.42 57.32,68.5 58.12,69.3 REGULATOR-LP2989.4 63.06,69.3 LP_C3.1
AC_1  (via drill 0.7)
  Top 0.61: 750-CBHD240-G.P$4 71.03,40.04 72.39,41.4 v75.31,41.4 | v75.31,41.4 75.56,41.4 75.81,41.65 | v75.31,41.4 75.81,41.4 76.07,41.65 75.18,41.65 74.54,42.29
  pour Top: 73.99,42.72 76.78,42.72 76.78,39.92 73.99,39.92
AC_2  (via drill 0.7)
  Top 0.61: 750-CBHD240-G.P$3 71.28,37.68 72.64,36.32 v75.31,36.32
  pour Top: 73.96,37.66 76.75,37.66 76.75,34.87 73.96,34.87
CLK  (via drill 0.6)
  Top 0.305: DRIVER3.3 24.61,29.99 v23.62,30.98 | DRIVER1.3 24.63,63.93 24.63,61.84 24,61.21 22.73,61.21 21.71,60.19 21.71,56.51 21.97,56.26 21.97,53.46 20.85,52.34 20.85,43.3 | v16.63,44.06 11.93,44.06 10.54,42.67 10.54,40.63 9.65,39.75 5.08,39.75 4.19,38.86 4.19,37.46 2.74,36.01 CC2650MODAMOHR.7 | v19.81,44.06 20.19,44.06 20.85,43.3 | 24.51,48.23 DRIVER2.3 24.61,47.72 24.63,47.7 24.63,47.49 23.74,46.6 23.74,46.22 23.24,45.71 v22.98,45.71 | 20.85,43.3 20.7,43.15 20.7,34.08 20.85,33.83 v20.85,33.4
  Bottom 0.305: v23.62,30.98 23.36,30.98 v20.85,33.4 | v16.63,44.06 v19.81,44.06 19.81,44.57 20.95,45.71 v22.98,45.71
GND  (via drill 0.51, 0.6, 3.5)
  Top 0.305: 71.5,20.86 C1_HALL1.2
  Top 0.406: A1304ELHLX-T.PIN3 69.46,21.71 70.19,20.99 C1_HALL1.2
  Top 0.61: 58.06,58.12 C3.2
  other vias: 45.5,30.47 29,40 45.5,49.53 38.81,23.01 54.55,24.86 8.89,63.29 49.55,40.41 21.81,67.86 11.37,54.27 15.03,67.81 3.3,35.15 49.47,47.67 50.74,47.67 52.01,47.67 49.47,46.4 50.74,46.4 52.01,46.4 49.5,45.18 50.77,45.18 52.04,45.18 74.65,47.77 75.92,47.77 77.19,47.77 74.65,46.5 75.92,46.5 77.19,46.5 74.67,45.28 75.94,45.28 77.21,45.28 50.34,12.54 42.77,27.27 15.9,11.63 20.32,11.78 49.7,36.44 50.97,36.44 52.24,36.44 49.7,35.17 50.97,35.17 52.24,35.17 49.73,33.95 51,33.95 52.27,33.95 20.98,53.97 16.48,35.71 22.88,43.56 19.35,9.37 36.24,22.98 37.84,27.68 39.11,27.68 37.84,26.41 39.11,26.41 22.45,47.82 12.01,58.01 13.51,67.81 15.34,41.68 66.77,35.15 22.32,28.42 18.77,47.65 4.21,36.04 6.45,40.66 15.62,39.52 16.61,32.66 2.76,43.91 49.68,29.69 50.95,29.69 52.22,29.69 49.68,28.42 50.95,28.42 52.22,28.42 49.7,27.2 50.97,27.2 52.24,27.2 24.02,57.91 16.73,41.63 22.88,41.52
  pour Top (isolate 0.305, rank 3, no thermals): -10.46,-0.18 -9.66,80 90.8,80 91.05,-0.01
  pour Bottom (isolate 0.406, rank 3, no thermals): -9.53,0.63 91.05,-0.12 90.8,80 -9.53,80
  pour Top: 2.66,38.55 8.86,38.55 8.86,32.35 2.66,32.35
  pour Route15 (no thermals): -10.8,80.89 93.72,80.89 93.72,-1.15 -10.8,-1.15
  cutout Top: 64.51,23.49 68.7,23.49 68.7,19.55 64.51,19.55
  cutout Route15: 64.38,23.49 68.58,23.49 68.58,19.55 64.38,19.55
  cutout Bottom: 64.51,23.49 68.7,23.49 68.7,19.55 64.51,19.55
  cutout Bottom: 30.22,10.03 33.27,10.03 33.27,6.34 30.22,6.34
  cutout Route15: 30.22,10.15 33.27,10.15 33.27,6.34 30.22,6.34
  cutout Top: 30.22,10.03 33.14,10.03 33.14,6.22 30.22,6.22
HALL1_OUT  (via drill 0.6)
  Top 0.406: CC2650MODAMOHR.15 9.33,31.68 19.43,21.58 v44.7,21.58 | v62.1,14.22 65.78,14.22 66.42,14.85 66.42,15.28 R1_HALL.1 66.2,17.84 C2_HALL1.1 66.05,20.52 A1304ELHLX-T.PIN2
  Bottom 0.406: v44.7,21.58 54.73,21.58 v62.1,14.22
HALL2_OUT  (via drill 0.6)
  Top 0.406: CC2650MODAMOHR.14 8.18,30.54 v16.89,21.84 | v26.41,12.31 28.57,10.15 28.57,8.5 29.77,7.3 U$1.2 35.55,7.3 R1_HALL2.1 36.5,11.14 C2_HALL2.1
  Bottom 0.406: v16.89,21.84 v26.41,12.31
LE  (via drill 0.6)
  Top 0.305: DRIVER3.4 25.27,28.44 v28.19,31.36 | v7.36,44.32 8.38,45.33 v16.38,45.33 | DRIVER1.4 25.27,60.83 v26.54,59.56 | v26.79,51.05 25.27,49.52 DRIVER2.4 25.27,47.37 24.51,46.6 24.51,45.59 25.01,45.08 v25.01,44.45 | CC2650MODAMOHR.8 1.92,34.92 1.27,34.92 1.01,35.17 1.01,44.32 1.77,45.08 v2.28,45.08
  Bottom 0.305: v16.38,45.33 15.36,44.32 15.36,43.56 16.25,42.67 24.51,42.67 | v26.54,59.56 26.79,59.3 v26.79,51.05 | v2.28,45.08 4.19,45.08 4.95,44.32 v7.36,44.32 | v28.19,31.36 28.19,34.79 25.27,37.71 25.27,41.9 24.51,42.67 | v25.01,44.45 25.01,43.17 24.51,42.67
LED1_B  (via drill 0.6)
  Top 0.305: LED1.3 40.77,78.86 44.7,78.86 46.35,77.21 v46.35,76.7 | DRIVER1.20 25.88,69.84 25.88,72.26 v26.08,72.46
  Bottom 0.305: v26.08,72.46 26.13,72.51 29.59,72.51 31.87,74.8 44.95,74.8 46.35,76.19 v46.35,76.7
LED1_G  (via drill 0.6)
  Top 0.305: v35.94,78.73 36.11,78.91 LED1.2 | DRIVER1.19 26.74,69.95 26.74,71.06 26.89,71.22 26.89,75.79 v27.3,76.19
  Bottom 0.305: v27.3,76.19 28.06,76.96 34.16,76.96 v35.94,78.73
LED1_R
  Top 0.305: LED1.1 38.92,78.06 38.65,77.79 30.48,77.79 27.4,74.72 27.4,69.95 DRIVER1.18
LED2_B
  Top 0.305: LED2.3 40.73,76.41 40,77.13 31.75,77.13 28.01,73.4 28.01,69.9 DRIVER1.17
LED2_G
  Top 0.305: DRIVER1.16 28.57,72.82 32,76.25 39.18,76.25 LED2.2
LED2_R
  Top 0.305: 39.23,75.53 LED2.1 32.23,75.49 29.26,72.51 29.26,70.84 DRIVER1.15
LED3_B
  Top 0.305: DRIVER1.14 29.89,71.93 32.53,74.57 39.93,74.57 LED3.3
LED3_G
  Top 0.305: LED3.2 32.7,73.78 30.7,71.78 30.7,69.95 DRIVER1.13
LED3_R
  Top 0.305: 39.12,72.77 LED3.1 34.9,72.93 31.06,69.08 31.06,64.46 DRIVER1.12
LED4_B
  Top 0.305: 29.89,64 29.89,64.18 | DRIVER1.11 29.89,64 | LED4.3 39.96,71.98 34.97,71.98 31.72,68.73 31.72,63.7 30.7,62.68 30.2,62.68 29.89,62.99 29.89,63.9 29.84,63.95 29.89,64
LED4_G
  Top 0.305: 29.21,63.8 29.23,63.82 DRIVER1.10 29.23,62.58 29.71,62.1 30.86,62.1 32.25,63.49 32.25,68.45 35.02,71.21 LED4.2
LED4_R
  Top 0.305: LED4.1 39.17,70.25 34.74,70.25 32.76,68.27 32.76,63.32 31.01,61.56 28.82,61.56 28.21,62.17 28.21,62.88 28.57,63.24 DRIVER1.9
LED5_B
  Top 0.305: DRIVER1.8 27.91,63.27 27.61,62.96 27.61,62.02 28.52,61.11 31.31,61.11 33.4,63.19 33.4,67.79 34.97,69.36 40.01,69.36 LED5.3
LED5_G
  Top 0.305: DRIVER1.7 27.25,63.27 27.05,63.06 27.05,61.87 28.37,60.55 31.52,60.55 34.31,63.34 34.31,67.58 35.23,68.5 39.13,68.5 LED5.2
LED5_R
  Top 0.305: LED5.1 39.22,67.74 35.48,67.74 34.82,67.08 34.82,63.49 34.82,63.24 34.82,63.04 31.82,60.04 28.16,60.04 26.59,61.61 DRIVER1.6
LED6_B
  Top 0.305: LED6.3 40.73,66.12 40.08,66.77 36.44,66.77 35.73,66.06 35.73,63.24 32.02,59.53 27.96,59.53 25.93,61.56 DRIVER1.5
LED6_G
  Top 0.305: LED6.2 37.2,66.08 36.47,65.35 36.47,63.14 32.38,59.05 27.66,59.05 26.16,57.55 26.16,55.75 25.93,55.52 DRIVER2.20 25.98,54.22
LED6_R
  Top 0.305: LED6.1 39.22,65.17 37.71,65.17 37,64.46 37,62.76 32.63,58.39 28.11,58.39 26.67,56.94 26.67,54.25 DRIVER2.19
LED7_B  (via drill 0.6)
  Top 0.305: 40.73,63.66 LED7.3 41.64,63.51 v42.01,63.88 | v28.37,57.53 28.14,57.53 27.35,56.74 27.35,54.27 DRIVER2.18
  Bottom 0.305: v42.01,63.88 34.11,63.88 32.58,62.35 32.58,61.74 v28.37,57.53
LED7_G
  Top 0.305: LED7.2 38.09,63.51 37.71,63.14 37.71,62.66 32.76,57.7 29.71,57.7 27.91,55.9 DRIVER2.17
LED7_R
  Top 0.305: LED7.1 39.14,62.53 38.4,62.53 32.94,57.07 29.89,57.07 28.57,55.75 DRIVER2.16
LED8_B
  Top 0.305: DRIVER2.15 29.23,55.65 30.12,56.53 33.29,56.53 38.45,61.69 40.46,61.69 40.73,61.42 LED8.3
LED8_G
  Top 0.305: LED8.2 39.16,60.83 38.43,60.83 33.5,55.9 30.4,55.9 29.89,55.39 DRIVER2.14
LED8_R
  Top 0.305: DRIVER2.13 31.59,55.21 33.62,55.21 38.51,60.1 LED8.1
LED9_B
  Top 0.305: LED9.3 39.91,59.2 38.48,59.2 33.75,54.48 32.41,54.48 30.55,52.62 DRIVER2.12
LED9_G
  Top 0.305: DRIVER2.11 29.89,47.39 30.15,47.14 30.8,47.14 31.16,47.49 31.16,52.32 32.74,53.89 34.08,53.89 38.57,58.38 LED9.2
LED9_R
  Top 0.305: LED9.1 39.01,57.27 38.4,57.27 31.75,50.62 31.75,46.96 31.31,46.53 30.04,46.53 29.38,47.19 29.38,48.18 DRIVER2.10
LED10_B  (via drill 0.6)
  Top 0.305: DRIVER2.9 28.6,48.31 v28.6,46.6 | v41.96,56.05 41.72,55.82 LED10.3
  Bottom 0.305: v41.96,56.05 41.96,56.1 41.45,56.61 38.45,56.61 35.38,53.54 30.17,53.54 29.36,52.72 29.36,47.14 28.98,46.76 v28.6,46.6
LED10_G
  Top 0.305: LED10.2 37.84,55.82 32.41,50.39 32.41,46.81 31.31,45.71 28.16,45.71 27.73,46.15 27.73,46.91 27.91,47.09 DRIVER2.8
LED10_R
  Top 0.305: LED10.1 39.26,54.99 37.89,54.99 33.04,50.13 33.04,46.38 31.8,45.13 27.86,45.13 27.17,45.82 27.17,48.25 DRIVER2.7
LED11_B  (via drill 0.6)
  Top 0.305: LED11.3 40.88,53.41 v42.06,53.41 | v26.28,46.3 26.59,46.6 DRIVER2.6
  Bottom 0.305: v42.06,53.41 40.74,52.09 33.04,52.09 30.63,49.68 30.63,45.61 30.04,45.03 26.94,45.03 26.28,45.69 v26.28,46.3
LED11_G
  Top 0.305: LED11.2 39.16,53.13 36.85,53.13 33.75,49.93 33.75,45.97 32.41,44.62 26.18,44.62 25.45,45.36 25.45,45.66 25.27,45.84 25.27,46.6 25.65,46.98 25.67,46.98 25.93,47.24 DRIVER2.5
LED11_R  (via drill 0.6)
  Top 0.305: LED11.1 37.37,52.4 v35.76,50.85 | v29.94,43.81 25.75,43.81 24.96,43.02 24.96,36.82 25.93,35.86 DRIVER3.20
  Bottom 0.305: v35.76,50.85 34.9,50.79 31.97,47.87 31.97,45.74 v29.94,43.81
LED12_B  (via drill 0.6)
  Top 0.305: LED12.3 41.21,50.69 v41.78,51.25 | DRIVER3.19 26.59,36.06 25.57,37.08 25.57,42.29 v26.31,43.02
  Bottom 0.305: v41.78,51.25 37.31,51.25 36.6,50.54 36.57,50.54 34.06,48.03 34.06,46.5 30.75,43 26.39,43.1 v26.31,43.02
LED12_G
  Top 0.305: LED12.2 37.05,50.69 34.36,48 34.36,45.69 32.69,44.01 31.54,44.01 30.5,42.97 27.43,42.97 26.21,41.75 26.21,37.21 27.28,36.14 27.28,33.57 DRIVER3.18
LED12_R
  Top 0.305: LED12.1 37.26,49.84 35.28,47.85 35.28,45.69 31.85,42.26 31.85,38.81 30.42,37.38 28.9,37.38 27.91,36.39 DRIVER3.17
LED13_B
  Top 0.305: LED13.3 40.73,48.62 40.23,49.12 37.61,49.12 36.06,47.57 36.06,45.44 32.53,41.9 32.53,38.55 30.6,36.62 29.36,36.62 28.57,35.83 DRIVER3.16
LED13_G
  Top 0.305: LED13.2 37.58,48.12 36.67,47.21 36.67,45.13 33.12,41.57 33.12,38.22 30.65,35.76 29.64,35.76 29.23,35.35 DRIVER3.15
LED13_R
  Top 0.305: LED13.1 38.08,47.27 37.23,46.43 37.23,44.88 33.8,41.45 33.8,38.07 30.91,35.17 30.15,35.17 29.87,34.89 29.87,33.57 DRIVER3.14
LED14_B  (via drill 0.6)
  Top 0.305: LED14.3 41.44,45.56 v41.85,45.97 | v31.69,34.46 31.47,34.46 DRIVER3.13
  Bottom 0.305: v31.69,34.46 32.38,35.15 32.38,42.67 34.77,45.05 36.11,45.05 37.03,45.97 37.03,47.04 38.04,48.05 39.77,48.05 v41.85,45.97
LED14_G  (via drill 0.6)
  Top 0.305: DRIVER3.12 30.55,32 33.24,34.69 33.24,36.55 v34.59,37.89 | v38.17,46.1 38.79,46.04 LED14.2
  Bottom 0.305: v34.59,37.89 34.59,42.39 35.81,43.61 35.83,43.61 v38.17,46.1
LED14_R  (via drill 0.6)
  Top 0.305: LED14.1 38.15,44.71 v37.87,44.27 | DRIVER3.11 29.89,26.84 30.42,26.31 v30.7,26.31
  Bottom 0.305: v37.87,44.27 35.53,41.93 35.53,37.33 35.12,36.93 35.12,35.5 30.09,30.47 30.09,26.56 30.11,26.55 30.18,26.55 30.42,26.31 v30.7,26.31
LED15_B  (via drill 0.6)
  Top 0.305: LED15.3 40.93,42.99 v41.68,43.73 | v29.1,26.05 29.1,27.58 DRIVER3.10
  Bottom 0.305: v41.68,43.73 38.58,43.73 37.59,42.74 37.51,42.74 36.75,41.98 36.75,37.43 35.96,36.65 35.96,35.07 31.77,30.88 31.77,26.05 31.11,25.39 29.76,25.39 v29.1,26.05
LED15_G
  Top 0.305: DRIVER3.9 28.57,26.77 28.29,26.49 28.29,25.62 28.77,25.14 30.86,25.14 32.1,26.39 32.25,26.39 32.25,31.01 35.76,34.51 35.76,38.2 35.02,38.93 35.02,41.35 36.67,42.99 LED15.2
LED15_R
  Top 0.305: LED15.1 36.93,42.14 36.01,41.22 36.01,39.06 36.93,38.15 36.93,34.59 33.09,30.75 33.09,26.26 31.14,24.56 28.7,24.56 27.71,25.42 27.71,26.56 28.01,26.87 28.01,27.6 DRIVER3.8
LED16_B  (via drill 0.6)
  Top 0.305: DRIVER3.7 27.25,26.79 27,26.54 27,25.34 28.34,24 31.85,24 33.85,26.26 33.85,30.32 v35.99,32.46 | v42.01,41.24 41.55,41.24 LED16.3
  Bottom 0.305: v35.99,32.46 35.99,33.37 41.68,39.06 41.68,40.91 v42.01,41.24
LED16_G
  Top 0.305: DRIVER3.6 26.59,26.89 26.34,26.64 26.34,25.22 28.19,23.49 32.76,23.49 34.56,25.67 34.56,29.86 37.99,33.29 37.99,39.95 38.58,40.53 39.17,40.53 LED16.2
LED16_R  (via drill 0.6)
  Top 0.305: LED16.1 39.28,33.48 v35.81,29.86 | v25.5,25.88 25.5,26.44 25.83,26.77 25.83,27.6 DRIVER3.5
  Bottom 0.305: v35.81,29.86 35.66,29.15 30.73,24.23 27.15,24.23 v25.5,25.88
MISO  (via drill 0.6)
  Top 0.305: v16.89,46.6 7.74,46.6 6.47,45.33 6.47,41.9 3.55,38.98 3.55,38.09 2.54,37.08 2.06,37.08 CC2650MODAMOHR.6 | v23.87,44.45 24.38,43.94 24.38,36.32 24.61,36.09 DRIVER3.22
  Bottom 0.305: v16.89,46.6 23.36,46.6 23.87,46.22 v23.87,44.45
MOSI  (via drill 0.6)
  Top 0.305: v6.12,49.52 16,49.78 18.03,52.06 v18.03,66.92 | CC2650MODAMOHR.5 2.24,38.31 3.04,39.11 3.04,39.62 5.2,41.78 v5.2,45.46 | v21.97,69.34 22.47,69.08 23.87,67.69 23.87,64.03 DRIVER1.2
  Bottom 0.305: v18.03,66.92 18.16,66.92 20.32,69.08 v21.97,69.34 | v6.12,49.52 5.2,48.61 v5.2,45.46
N$1
  Top 0.406: 55.02,52.7 TPS560200.3
  Top 0.61: 55.02,52.7 52.19,52.7 51.41,53.49 INDUCTOR.P$1
N$2
  Top 0.305: 23.74,36.06 24,35.81 24,33.6 DRIVER3.23
  Top 0.406: 23.74,36.06 23.03,36.77 R_D3.1
N$3
  Top 0.61: TPS560200.5 60.7,57.87 R2.1 R1.2
N$5  (via drill 0.6)
  Top 0.305: v11.17,56 12.19,54.99 12.44,54.99 | 15.36,59.43 14.73,58.8 11.55,58.8 10.92,58.16 11.55,57.02 12.44,56.13 12.44,54.99 | R4.1 8.76,59.32 8.76,58.29 v9.14,57.91 | TPS1.5 16.18,54.17 15.36,54.99 12.44,54.99
  Top 0.406: R3.2 15.36,59.57 15.36,59.43
  Bottom 0.305: v9.14,57.91 9.27,57.78 10.03,57.78 11.04,56.76 11.17,56.76 v11.17,56
N$6
  Top 0.305: INDUCTOR1.P$1 3.55,54.75 3.55,51.05 4.19,50.41 11.55,50.41 13.02,51.88 TPS1.3
N$7
  Top 0.305: DRIVER2.23 24,54.22 24,55.49 24.25,55.75 24.25,56.26 23.24,57.27 22.86,57.27 22.35,57.78 22.35,58.03 22.82,58.51 R_D2.1
N$8
  Top 0.305: DRIVER1.23 23.95,70.53 23.49,70.99 23.49,72.68 R_D1.1
N$10
  Top 0.61: REGULATOR-LP2989.1 64.04,65.49 LP_C1.1
NRESET
  Top 0.406: HEADER-PHB.5 40.64,14.98 39.85,14.19 17.8,14.19 4.89,27.11 RL1.2 | 6.98,32.61 CC2650MODAMOHR.13 7.03,32.3 4.95,30.22 4.95,29.52 | RL1.2 4.95,29.52 | RL1.2 4.95,29.52
OE  (via drill 0.6)
  Top 0.305: DRIVER1.21 v25.27,74.93 | v20.32,73.53 19.81,73.02 v19.81,52.83 19.81,49.65 | 19.81,49.65 19.81,45.71 18.79,44.7 18.79,37.21 19.17,36.57 v19.55,36.44 | v25.14,31.11 25.27,31.24 DRIVER3.21 | DRIVER2.21 25.27,51.81 v24.89,51.43 | 19.81,49.65 19.55,49.65 18.41,48.51 5.33,48.51 4.19,47.37 4.19,41.52 2.41,39.75 2.27,39.75 CC2650MODAMOHR.4
  Bottom 0.305: v25.27,74.93 24.76,75.43 23.11,75.43 21.2,73.53 v20.32,73.53 | v25.14,31.11 24.89,31.11 24.25,31.74 24.25,35.55 23.74,36.06 19.68,36.06 v19.55,36.44 | v19.81,52.83 21.2,51.43 v24.89,51.43
SERIN1  (via drill 0.6)
  Top 0.305: DRIVER1.22 24.63,69.82 v24.38,71.5 | v18.66,69.59 18.92,69.34 v18.92,51.3 | v23.62,50.54 23.95,50.21 DRIVER2.2
  Bottom 0.305: v24.38,71.5 24,71.88 22.98,71.88 22.86,71.62 22.86,70.73 22.35,70.48 19.3,70.48 18.66,69.84 v18.66,69.59 | v18.92,51.3 19.68,50.54 v23.62,50.54
SERIN2
  Top 0.305: DRIVER3.2 23.95,26.97 24,26.92 24,28.32 21.84,30.47 21.84,34.03 21.59,34.28 21.59,41.78 21.84,42.03 21.84,43.68 21.59,43.94 21.59,50.77 21.71,50.9 23.01,52.57 24.12,52.57 24.61,53.06 DRIVER2.22
TCK  (via drill 0.6)
  Top 0.305: CC2650MODAMOHR.10 3.17,32.2 v3.17,30.98
  Top 0.406: v15.36,18.28 17.14,18.28 17.65,18.79 40.89,18.79 41.4,18.28 41.4,17.9 HEADER-PHB.6
  Bottom 0.305: v3.17,30.98 3.42,30.73 3.42,28.19 4.69,26.92 4.69,24.38 10.79,18.28 v15.36,18.28
TDI  (via drill 0.6)
  Top 0.305: CC2650MODAMOHR.12 5.71,32.78 v5.71,33.52
  Top 0.406: HEADER-PHB.10 44.19,18.16 44.19,19.81 43.43,20.57 v13.33,20.57
  Bottom 0.305: v5.71,33.52 4.95,32.76 4.95,29.2 6.47,27.68 6.47,25.39 11.3,20.57 v13.33,20.57
TDO  (via drill 0.6)
  Top 0.305: CC2650MODAMOHR.11 4.44,32.9 v4.44,33.78
  Top 0.406: v14.35,19.55 41.78,19.55 42.67,18.66 42.67,17.9 HEADER-PHB.8
  Bottom 0.305: v4.44,33.78 4.19,33.52 4.19,29.71 4.44,29.46 4.44,28.44 5.46,27.43 5.46,24.63 10.54,19.55 v14.35,19.55
TMS  (via drill 0.6)
  Top 0.305: 1.9,33.63 CC2650MODAMOHR.9
  Top 0.406: v11.68,17.14 10.79,17.14 6.47,21.46 6.47,24.12 2.66,27.93 2.66,29.71 1.98,30.39 CC2650MODAMOHR.9 | v16.38,17.27 35.3,17.27 36.06,18.03 38.48,18.03 HEADER-PHB.4
  Bottom 0.406: v11.68,17.14 11.81,17.27 v16.38,17.27
V+
  Top 0.61: 59.94,53.97 60.83,54.86 60.92,54.77 C2.1 64.71,54.77 C6.1 | 59.94,53.97 59.26,53.29 TPS560200.4 | 750-CBHD240-G.P$2 59.01,40.04 C1_REC.1 58.05,43.84 R1_REC.1 58.2,50.45 60.57,52.83 60.57,53.34 59.94,53.97
  pour Top: 59.69,49.91 66.8,49.91 66.8,38.86 61.72,38.86 61.08,38.86 61.08,45.46 59.69,45.46